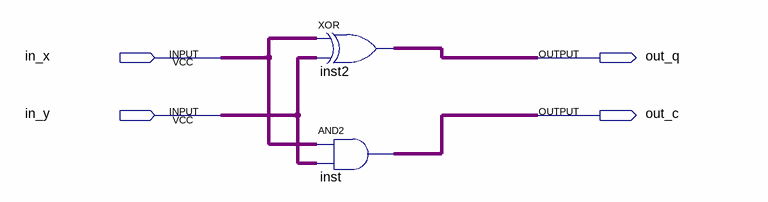
[diagram p0: schematic sheet]
// Quartus schematic SM1.bdf as structural Verilog: 2 symbols, 4 pins
module SM1 (
  input  in_x,
  input  in_y,
  output out_q,
  output out_c
);

  xor inst2 (out_q, in_x, in_y);
  and inst (out_c, in_x, in_y);
endmodule
